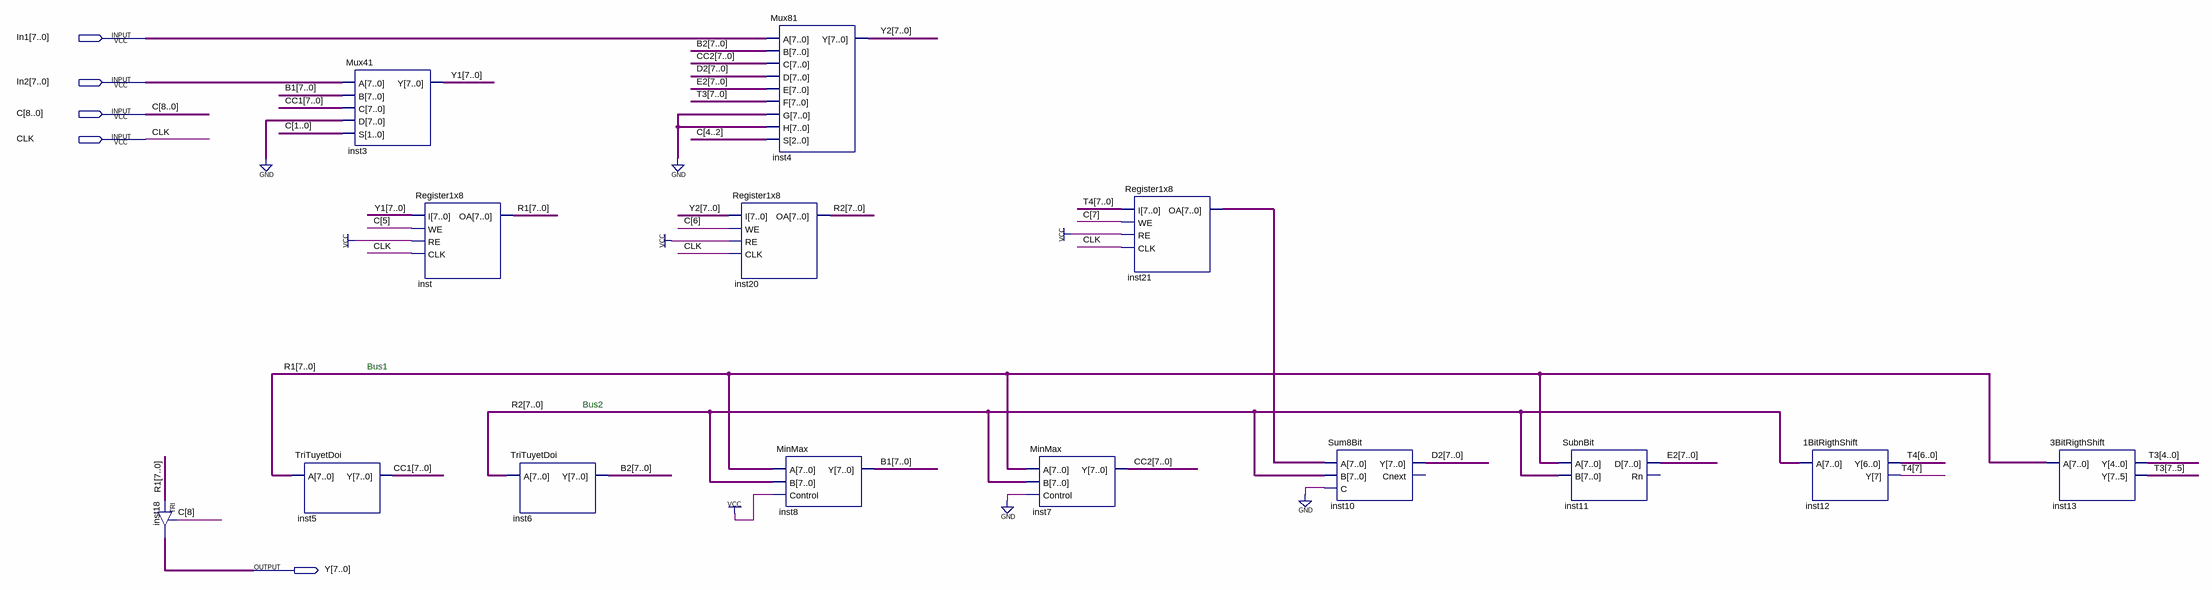
[diagram p0: schematic sheet]
// Quartus schematic Datapath.bdf as structural Verilog: 14 symbols, 5 pins
module Datapath (
  input  [7:0] In1,
  input  [7:0] In2,
  input  [8:0] C,
  input  CLK,
  output [7:0] Y
);

  wire [7:0] B1, B2, CC1, CC2, D2, E2, inst21_oa, R1, R2, T3, T4, Y1, Y2;

  TRI inst18[7:0] (.IN(R1), .OE(C[8]), .OUT(Y));
  TriTuyetDoi inst5 (.A(R1), .Y(CC1));
  Mux41 inst3 (.A(In2), .B(B1), .C(CC1), .D({8{1'b0}}), .S(C[1:0]), .Y(Y1));
  Register1x8 inst (.I(Y1), .WE(C[5]), .RE(1'b1), .CLK(CLK), .OA(R1));
  TriTuyetDoi inst6 (.A(R2), .Y(B2));
  Mux81 inst4 (.A(In1), .B(B2), .C(CC2), .D(D2), .E(E2), .F(T3), .G({8{1'b0}}), .H({8{1'b0}}), .S(C[4:2]), .Y(Y2));
  Register1x8 inst20 (.I(Y2), .WE(C[6]), .RE(1'b1), .CLK(CLK), .OA(R2));
  MinMax inst8 (.A(R1), .B(R2), .Control(1'b1), .Y(B1));
  MinMax inst7 (.A(R1), .B(R2), .Control(1'b0), .Y(CC2));
  Register1x8 inst21 (.I(T4), .WE(C[7]), .RE(1'b1), .CLK(CLK), .OA(inst21_oa));
  Sum8Bit inst10 (.A(inst21_oa), .B(R2), .C(1'b0), .Y(D2));  // open: Cnext
  SubnBit inst11 (.A(R1), .B(R2), .D(E2));  // open: Rn
  \1BitRigthShift  inst12 (.A(R2), .Y(T4));
  \3BitRigthShift  inst13 (.A(R1), .Y(T3));

  // Notes on the sheet:
  //   Bus1
  //   Bus2
endmodule
